# Altium schematic sheet rf_trsw.SchDoc: mcHF QRP Transceiver RF board
size A4; Author: K Atanassov; CompanyName: M0NKA; Revision: 0.6.3; SheetTotal: 12
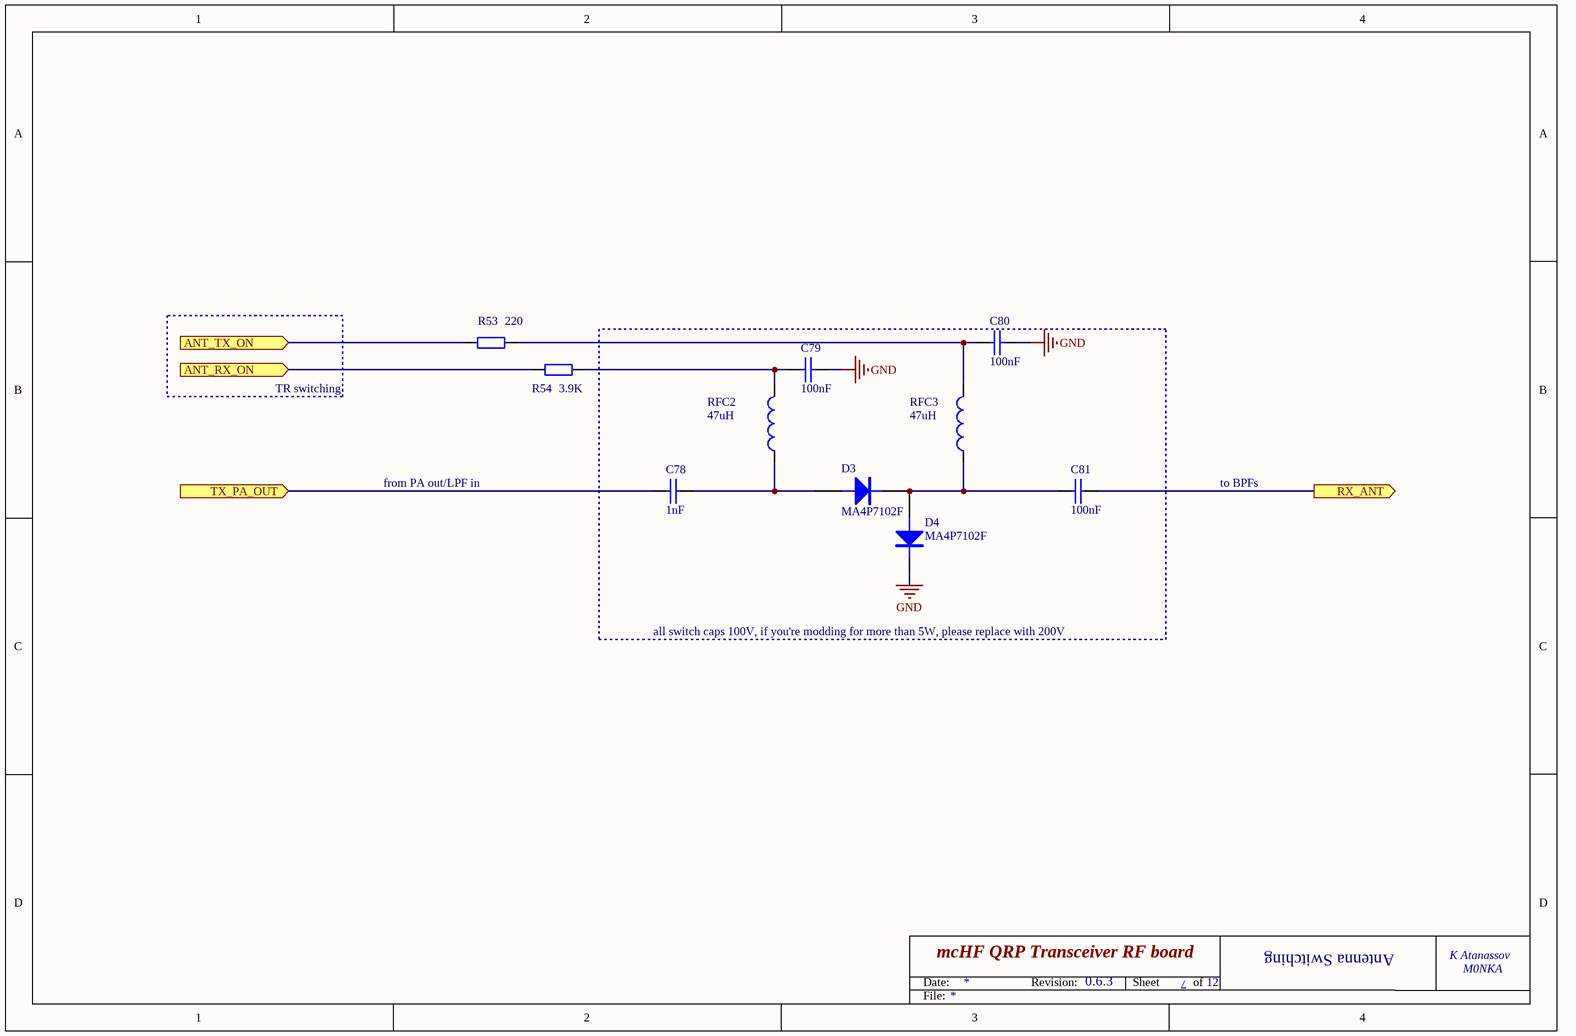
[diagram p0: rf_trsw.SchDoc]

## Parts
C78  1nF  [0805-Pro]
C79  100nF  [0805-Pro]
C80  100nF  [0805-Pro]
C81  100nF  [0805-Pro]
D3  MA4P7102F  [1072T]
D4  MA4P7102F  [1072T]
R53  220  [0805-Pro]
R54  3.9K  [0805-Pro]
RFC2  47uH  [0805-Pro]
RFC3  47uH  [0805-Pro]

## Ports
ANT_RX_ON (in), ANT_TX_ON (in), RX_ANT (out), TX_PA_OUT (in)

## Nets
GND: C79.1 C80.1 D4.1(K)
ANT_RX_ON: R54.1 ; port ANT_RX_ON
ANT_TX_ON: R53.2 ; port ANT_TX_ON
RX_ANT: C81.1 ; port RX_ANT
TX_PA_OUT: C78.2 ; port TX_PA_OUT
NetC78_1: C78.1 D3.2(A) RFC2.1
NetC79_2: C79.2 R54.2 RFC2.2
NetC80_2: C80.2 R53.1 RFC3.2
NetC81_2: C81.2 D3.1(K) D4.2(A) RFC3.1

## Notes on the sheet
- TR switching
- from PA out/LPF in
- to BPFs
- all switch caps 100V, if you're modding for more than 5W, please replace with 200V
- 7
- Antenna Switching
- Date:
- Revision:
- Sheet
- of
- File:

## Library data of the parts
C78 = CAP: Capacitor; Order: FN 136-2553; Voltage: 100V; QT Order: QCC-00259; Price: 0.083
C79-C81 = CAP: Capacitor; Order: FN 252-2090; Voltage: 100V; QT Order: QCC-00154; Price: 0.068
D3 D4 = MA4P7102F: MELF & HIPAX PIN Diod; Order: DK 1465-1236-1-ND; Price: 2.20
R53 = RES: Resistor; Order: FN 933-2804; QT Order: QCR-00309; Price: 0.007
R54 = RES: Resistor; Order: FN 165-2998; QT Order: QCR-00339; Price: 0.012
RFC2 RFC3 = TDK-NLV25T: INDUCTOR, SIGNAL LINE, 4.7UH, 1005; Order: FN 166-9895; Price: 0.166